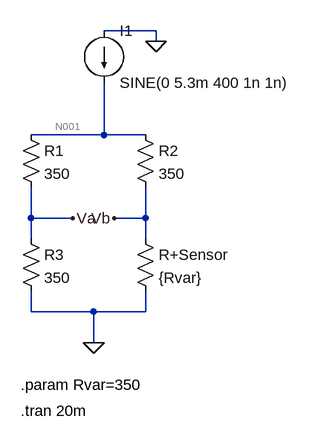
[diagram p0: schematic wheatstone_bridge.asc]
wheatstone_bridge.asc, the LTspice schematic file:
Version 4.1
SHEET 1 880 680
WIRE 336 -112 256 -112
WIRE 336 -96 336 -112
WIRE 256 48 256 -32
WIRE 256 48 144 48
WIRE 320 48 256 48
WIRE 144 176 144 128
WIRE 208 176 144 176
WIRE 320 176 320 128
WIRE 320 176 272 176
WIRE 144 208 144 176
WIRE 320 208 320 176
WIRE 144 320 144 288
WIRE 240 320 144 320
WIRE 320 320 320 288
WIRE 320 320 240 320
WIRE 240 368 240 320
FLAG 240 368 0
FLAG 336 -96 0
FLAG 272 176 Vb
FLAG 208 176 Va
SYMBOL res 128 32 R0
SYMATTR InstName R1
SYMATTR Value 350
SYMBOL res 304 32 R0
SYMATTR InstName R2
SYMATTR Value 350
SYMBOL res 128 192 R0
SYMATTR InstName R3
SYMATTR Value 350
SYMBOL res 304 192 R0
SYMATTR InstName R+Sensor
SYMATTR Value {Rvar}
SYMBOL current 256 -112 R0
WINDOW 123 0 0 Left 0
WINDOW 39 0 0 Left 0
SYMATTR InstName I1
SYMATTR Value SINE(0 5.3m 400 1n 1n)
TEXT 128 432 Left 2 !.param Rvar=350
TEXT 128 472 Left 2 !.tran 20m

The netlist it stands for:
* wheatstone_bridge.asc
R1 N001 Va 350
R2 N001 Vb 350
R3 Va 0 350
R+Sensor Vb 0 {Rvar}
I1 0 N001 SINE(0 5.3m 400 1n 1n)
.param Rvar=350
.tran 20m
.backanno
.end

* Results of the author's LTspice run, read from the files saved beside the schematic
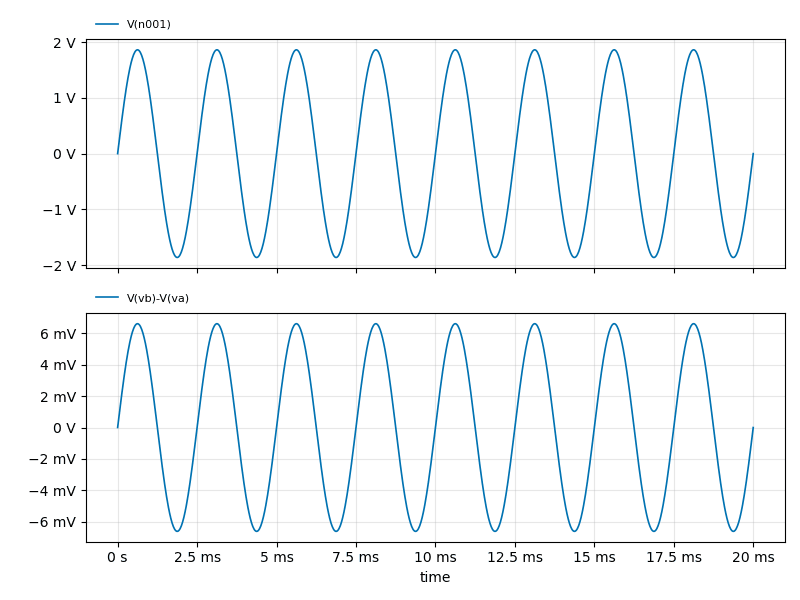
[diagram p1: Transient Analysis of wheatstone_bridge.asc, plotted from the saved traces]
* Transient Analysis, 1 run:
*   V(n001): min -1.861 V, max 1.861 V, average 0 V, rms 1.316 V, last -4.679 µV
*   V(vb)-V(va): min -6.601 mV, max 6.601 mV, average 0 V, rms 4.668 mV, last -16.59 nV